# Altium schematic sheet Source_Select.SchDoc: Programming Source Select
size A; Organization: UCLA High Energy Physics; DocumentNumber: 14; Revision: 2.0; SheetNumber: 14; SheetTotal: 23; CurrentDate: 9/6/2018; ModifiedDate: 9/6/2018
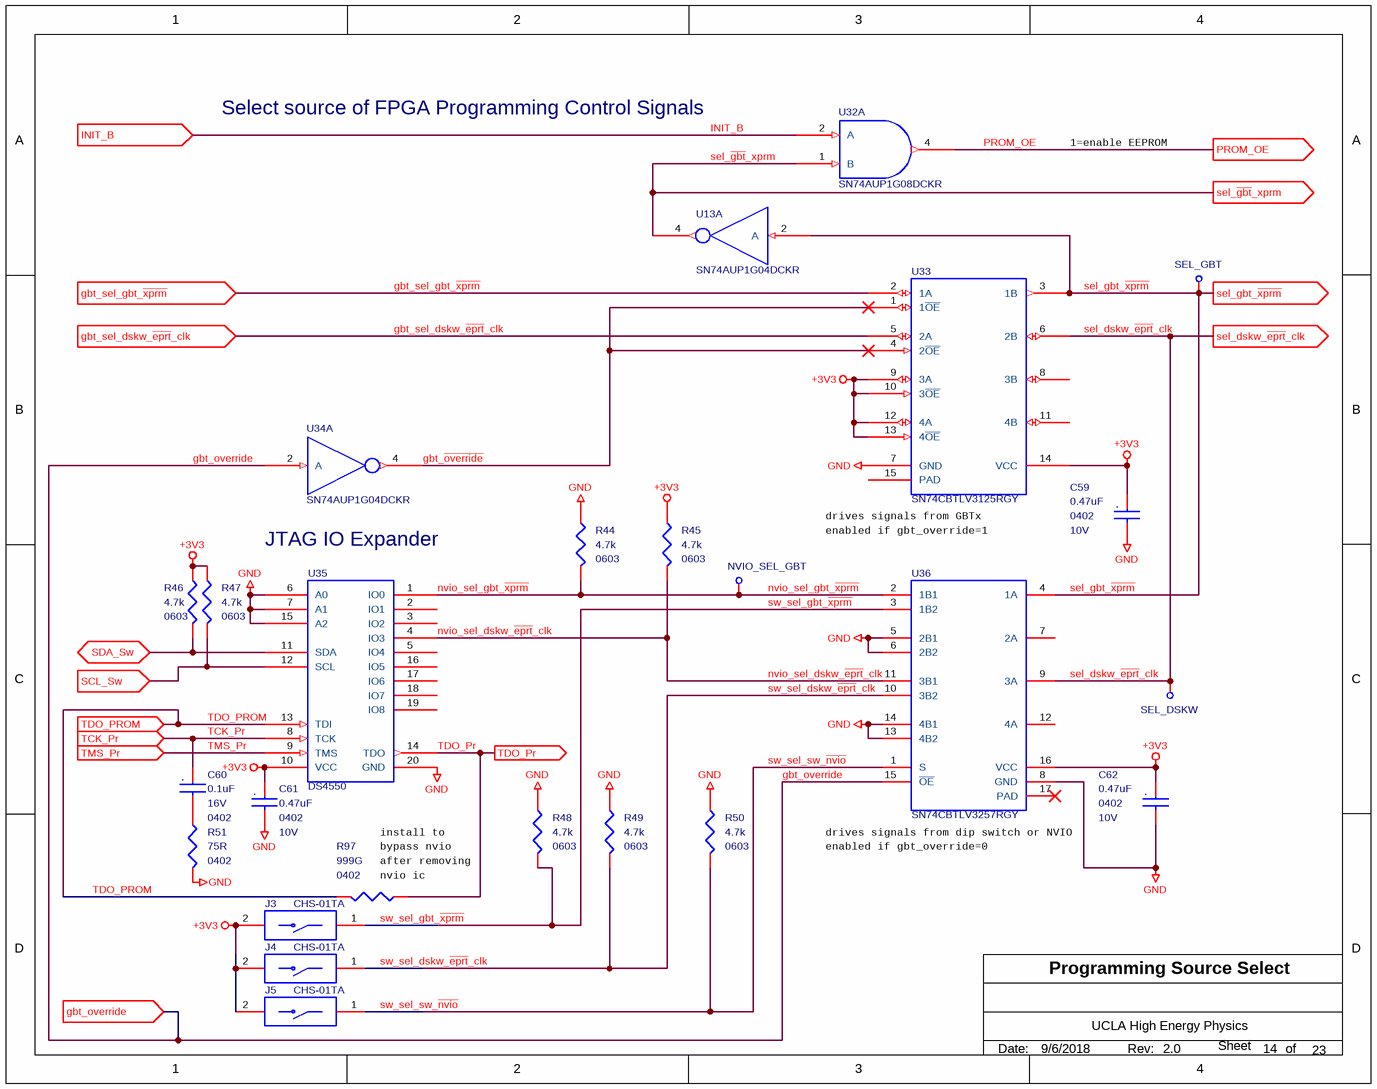
[diagram p0: Source_Select.SchDoc]

## Parts
C59  0.47uF  Voltage - Rated: 10V  package: 0402  [MC_S6/SM/C_0402_IPC]
C60  0.1uF  package: 0402  Voltage - Rated: 16V  [MC_S6/SM/C_0402_IPC]
C61  0.47uF  Voltage - Rated: 10V  package: 0402  [MC_S6/SM/C_0402_IPC]
C62  0.47uF  Voltage - Rated: 10V  package: 0402  [MC_S6/SM/C_0402_IPC]
J3  CHS-01TA  [CHS-01TA]
J4  CHS-01TA  [CHS-01TA]
J5  CHS-01TA  [CHS-01TA]
NVIO_SEL_GBT  Test Point Via  [MC_S6/TH/TPVIA]  (value not drawn)  (no BOM)
R44  4.7k  Supplier Device Package: 0603  [MC_S6/SM/R_0603_IPC]
R45  4.7k  Supplier Device Package: 0603  [MC_S6/SM/R_0603_IPC]
R46  4.7k  Supplier Device Package: 0603  [MC_S6/SM/R_0603_IPC]
R47  4.7k  Supplier Device Package: 0603  [MC_S6/SM/R_0603_IPC]
R48  4.7k  Supplier Device Package: 0603  [MC_S6/SM/R_0603_IPC]
R49  4.7k  Supplier Device Package: 0603  [MC_S6/SM/R_0603_IPC]
R50  4.7k  Supplier Device Package: 0603  [MC_S6/SM/R_0603_IPC]
R51  75R  Supplier Device Package: 0402  [MC_S6/SM/R_0402_IPC]
R97  999G  Supplier Device Package: 0402  [MC_S6/SM/R_0402_IPC]  (no BOM)
SEL_DSKW  Test Point Via  [MC_S6/TH/TPVIA]  (value not drawn)  (no BOM)
SEL_GBT  Test Point Via  [MC_S6/TH/TPVIA]  (value not drawn)  (no BOM)
U13  SN74AUP1G04DCKR  [MC_S6/SM/SOT_SC70_DCK5]  (part A of 2)
U32  SN74AUP1G08DCKR  [MC_S6/SM/SOT_SC70_DCK5]  (part A of 2)
U33  SN74CBTLV3125RGY  [S-PVQFN-N14]
U34  SN74AUP1G04DCKR  [MC_S6/SM/SOT_SC70_DCK5]  (part A of 2)
U35  DS4550  [TSSOP-20]
U36  SN74CBTLV3257RGY  [R-PVQFN-N16]

## Ports
gbt_override (in), gbt_sel_dskw_~{eprt}_clk (in), gbt_sel_gbt_~{xprm} (in), INIT_B (in), PROM_OE (out), SCL_Sw (in), SDA_Sw (bidir), sel_dskw_~{eprt}_clk (out), sel_gbt_~{xprm} (out), sel_~{gbt}_xprm (out), TCK_Pr (in), TDO_Pr (out), TDO_PROM (in), TMS_Pr (in)

## Nets
+3V3: C59.1 C61.1 C62.1 J3.2 J4.2 J5.2 R45.1 R46.1 R47.1 U33.9(3A) U33.10(3~{OE}) U33.12(4A) U33.13(4~{OE}) U33.14(VCC) U35.10(VCC) U36.16(VCC)
GND: C59.2 C61.2 C62.2 R44.1 R48.1 R49.1 R50.1 R51.2 U33.7(GND) U35.6(A0) U35.7(A1) U35.15(A2) U35.20(GND) U36.5(2B1) U36.6(2B2) U36.8(GND) U36.13(4B2) U36.14(4B1)
gbt_~{override}: U33.1(1~{OE}) U33.4(2~{OE}) U34.4(Y)
gbt_override: U34.2(A) U36.15(~{OE}) ; port gbt_override
gbt_sel_dskw_~{eprt}_clk: U33.5(2A) ; port gbt_sel_dskw_~{eprt}_clk
gbt_sel_gbt_~{xprm}: U33.2(1A) ; port gbt_sel_gbt_~{xprm}
INIT_B: U32.2(A) ; port INIT_B
nvio_sel_dskw_~{eprt}_clk: R45.2 U35.4(IO3) U36.11(3B1)
nvio_sel_gbt_~{xprm}: NVIO_SEL_GBT.1(In) R44.2 U35.1(IO0) U36.2(1B1)
PROM_OE: U32.4(Y) ; port PROM_OE
SCL_Sw: R47.2 U35.12(SCL) ; port SCL_Sw
SDA_Sw: R46.2 U35.11(SDA) ; port SDA_Sw
sel_dskw_~{eprt}_clk: SEL_DSKW.1(In) U33.6(2B) U36.9(3A) ; port sel_dskw_~{eprt}_clk
sel_~{gbt}_xprm: U13.4(Y) U32.1(B) ; port sel_~{gbt}_xprm
sel_gbt_~{xprm}: SEL_GBT.1(In) U13.2(A) U33.3(1B) U36.4(1A) ; port sel_gbt_~{xprm}
sw_sel_dskw_~{eprt}_clk: J4.1 R49.2 U36.10(3B2)
sw_sel_gbt_~{xprm}: J3.1 R48.2 U36.3(1B2)
sw_sel_sw_~{nvio}: J5.1 R50.2 U36.1(S)
TCK_Pr: C60.1 U35.8(TCK) ; port TCK_Pr
TDO_Pr: R97.1 U35.14(TDO) ; port TDO_Pr
TDO_PROM: R97.2 U35.13(TDI) ; port TDO_PROM
TMS_Pr: U35.9(TMS) ; port TMS_Pr
NetC60_2: C60.2 R51.1

Not connected (* = marked no-connect by the designer): U33 8(3B) 11(4B) 15(PAD); U35 2(IO1) 3(IO2) 5(IO4) 16(IO5) 17(IO6) 18(IO7) 19(IO8); U36 7(2A) 12(4A) 17(PAD)*

## Notes on the sheet
- Select source of FPGA Programming Control Signals
- 1=enable EEPROM
- enabled if gbt_override=1
- (near U33) drives signals from GBTx
- JTAG IO Expander
- install to
- (near R97) bypass nvio
- (near R97) after removing
- (near R97) nvio ic
- (near U36) enabled if gbt_override=0
- (near U36) drives signals from dip switch or NVIO
- Date:
- Rev:
- of
- Sheet
- (in symbol C0402C104K4RACTU) .
- (in symbol GRM155R61A474KE15D) .

## Library data of the parts
C59 C61 C62 = GRM155R61A474KE15D: CAP CER 0.47UF 10V X5R 0402; Manufacturer: Murata Electronics North America; Capacitance: 0.47µF; Tolerance: ±10%; Supplier 1: Digi-Key; Manufacturer Part Number: GRM155R61A474KE15D; RoHS: RoHS Compliant; Category: Capacitors; Stock 1: 506743; Pricing 1: 1=0.1, 10=0.064, 50=0.0344, 100=0.0292, 250=0.02384, 500=0.0204, 1000=0.0159, 5000=0.01325 (USD); Packaging: Cut Tape (CT); Part Status: Active; Operating Temperature: -55°C ~ 85°C; Features: -; Ratings: -; Applications: General Purpose; Mounting Type: Surface Mount, MLCC; Package / Case: 0402 (1005 Metric); Size / Dimension: 0.039" L x 0.020" W (1.00mm x 0.50mm); Height - Seated (Max): -; Thickness (Max): 0.022" (0.55mm); Lead Spacing: -; Lead Style: -; ComponentLink1URL: http://www.murata.com/~/media/webrenewal/support/library/catalog/products/capacitor/mlcc/c02e.pdf; ComponentLink1Description: http://www.murata.com/~/media/webrenewal/support/library/catalog/products/capacitor/mlcc/c02e.pdf; Supplier 2: Digi-Key; Stock 2: 506743; Pricing 2: 1=0.1, 10=0.064, 50=0.0344, 100=0.0292, 250=0.02384, 500=0.0204, 1000=0.0159, 5000=0.01325 (USD); Supplier Part Number 1: 490-3264-1-ND; Supplier Part Number 2: 490-3264-6-ND; Temperature Coefficient: X5R
C60 = C0402C104K4RACTU: CAP CER 0.1UF 16V X7R 0402; Manufacturer: KEMET; Capacitance: 0.10µF; Tolerance: ±10%; Supplier 1: Digi-Key; Manufacturer Part Number: C0402C104K4RACTU; RoHS: RoHS Compliant; Category: Capacitors; Stock 1: 3565698; Pricing 1: 1=0.11, 10=0.078, 25=0.0568, 50=0.0442, 100=0.0365, 250=0.03024, 500=0.02562, 1000=0.02121, 5000=0.01806 (USD); Packaging: Cut Tape (CT); Part Status: Active; Operating Temperature: -55°C ~ 125°C; Features: -; Ratings: -; Applications: General Purpose; Failure Rate: -; Mounting Type: Surface Mount, MLCC; Package / Case: 0402 (1005 Metric); Size / Dimension: 0.039" L x 0.020" W (1.00mm x 0.50mm); Height - Seated (Max): -; Thickness (Max): 0.022" (0.55mm); Lead Spacing: -; Lead Style: -; ComponentLink1URL: http://www.kemet.com/docfinder?Partnumber=C0402C104K4RACTU; ComponentLink1Description: http://www.kemet.com/docfinder?Partnumber=C0402C104K4RACTU; Supplier 2: Digi-Key; Stock 2: 3565998; Pricing 2: 1=0.11, 10=0.078, 25=0.0568, 50=0.0442, 100=0.0365, 250=0.03024, 500=0.02562, 1000=0.02121, 5000=0.01806 (USD); Supplier Part Number 1: 399-3521-1-ND; Supplier Part Number 2: 399-3521-6-ND; Temperature Coefficient: X7R
J3-J5 = CHS-01TA: SWITCH SLIDE DIP SPST 100MA 6V; Manufacturer: Nidec Copal; Body Material: Polyphenylene; Number of Positions: 1; Electrical Life: 2000Cycles; Max Voltage Rating (DC): 24V; Pitch: 0.05inch; Washable: Yes; ComponentLink1URL: https://www.ctscorp.com/wp-content/uploads/219.pdf; ComponentLink1Description: https://www.ctscorp.com/wp-content/uploads/219.pdf; Supplier 1: Digi-Key; Manufacturer Part Number: CHS-01TA; Stock 1: 148558; Pricing 1: 1=0.98, 10=0.961, 25=0.9056, 50=0.85, 100=0.8131, 250=0.77616, 500=0.70224 (USD); Mount: Surface Mount; Contact Material: Copper Alloy; Contact Plating: Gold; Min Operating Temperature: -40°C; Max Operating Temperature: 85°C; Packaging: Tape and Reel; Throw Configuration: SPST; Voltage Rating (DC): 6V; Current Rating: 100mA; Termination: J-Hook; Orientation: Vertical; Length: 0.098inch; Lead Free: Lead Free; ComponentLink2URL: https://datasheet.ciiva.com/2863/chs-2863448.pdf; ComponentLink2Description: https://datasheet.ciiva.com/2863/chs-2863448.pdf; ComponentLink3URL: https://datasheet.ciiva.com/2863/chs-2863449.pdf; ComponentLink3Description: https://datasheet.ciiva.com/2863/chs-2863449.pdf; ComponentLink4URL: https://datasheet.ciiva.com/2863/chs-2863450.pdf; ComponentLink4Description: https://datasheet.ciiva.com/2863/chs-2863450.pdf; Supplier Part Number 1: 563-1003-1-ND
NVIO_SEL_GBT SEL_DSKW SEL_GBT = TPVIA: COMPSIDE: TOP; COMPGROUP: 0; mfgr: Layout; COMPROT: 0; Package: 90; mfgr_id: TPVIA; mfgr_foot: TPVIA
R44-R50 = CR0603-FX-4701ELF: RES SMD 4.7K OHM 1% 1/10W 0603; Manufacturer: Bourns Inc.; Power (Watts): 0.1W, 1/10W; Temperature Coefficient: ±100ppm/°C; Tolerance: ±1%; Supplier 1: Digi-Key; Manufacturer Part Number: CR0603-FX-4701ELF; RoHS: RoHS Compliant; Category: Resistors; Stock 1: 43560; Pricing 1: 1=0.1, 10=0.021, 100=0.0086, 1000=0.00385, 2500=0.00334 (USD); Packaging: Cut Tape (CT); Part Status: Active; Resistance (Ohms): 4.7k; Composition: Thick Film; Features: Moisture Resistant; Operating Temperature: -55°C ~ 155°C; Package / Case: 0603 (1608 Metric); Size / Dimension: 0.063" L x 0.031" W (1.60mm x 0.80mm); Height - Seated (Max): 0.022" (0.55mm); Failure Rate: -; ComponentLink1URL: http://www.bourns.com/docs/Product-Datasheets/CHPREZTR.pdf; ComponentLink1Description: http://www.bourns.com/docs/Product-Datasheets/CHPREZTR.pdf; Supplier 2: Digi-Key; Stock 2: 43560; Pricing 2: 1=0.1, 10=0.021, 100=0.0086, 1000=0.00385, 2500=0.00334 (USD); Supplier Part Number 1: CR0603-FX-4701ELFCT-ND; Supplier Part Number 2: CR0603-FX-4701ELFDKR-ND
R51 = ERJ-2GEJ750X: RES SMD 75 OHM 5% 1/10W 0402; Manufacturer: Panasonic Electronic Components; Power (Watts): 0.1W, 1/10W; Temperature Coefficient: ±200ppm/°C; Tolerance: ±5%; Supplier 1: Digi-Key; Manufacturer Part Number: ERJ-2GEJ750X; RoHS: RoHS Compliant; Category: Resistors; Stock 1: 127750; Pricing 1: 1=0.1, 10=0.02, 100=0.008, 1000=0.00359, 2500=0.00312, 5000=0.00258 (USD); Packaging: Cut Tape (CT); Part Status: Active; Composition: Thick Film; Features: Automotive AEC-Q200; Operating Temperature: -55°C ~ 155°C; Package / Case: 0402 (1005 Metric); Size / Dimension: 0.039" L x 0.020" W (1.00mm x 0.50mm); Height - Seated (Max): 0.016" (0.40mm); Failure Rate: -; ComponentLink1URL: http://industrial.panasonic.com/www-cgi/jvcr13pz.cgi?E+PZ+3+AOA0001+ERJ2GEJ750X+7+WW; ComponentLink1Description: http://industrial.panasonic.com/www-cgi/jvcr13pz.cgi?E+PZ+3+AOA0001+ERJ2GEJ750X+7+WW; Supplier 2: Digi-Key; Stock 2: 127750; Pricing 2: 1=0.1, 10=0.02, 100=0.008, 1000=0.00359, 2500=0.00312, 5000=0.00258 (USD); Supplier Part Number 1: P75JCT-ND; Supplier Part Number 2: P75JDKR-ND
R97 = RES999G 0402: RES SMD 999G OHM 5% 1/16W 0402; Manufacturer Part Number: Do Not Place
U13 U34 = SN74AUP1G04DCKR: IC INVERTER LP 5TSSOP; Manufacturer: Texas Instruments; Number of Inputs: 1; Voltage - Supply: 0.8 V ~ 3.6 V; Current - Output High, Low: 4mA, 4mA; Logic Level - Low: 0.7 V ~ 0.9 V; Logic Level - High: 1.6 V ~ 2 V; Max Propagation Delay @ V, Max CL: 5.4ns @ 3.3V, 30pF; Supplier 1: Digi-Key; Manufacturer Part Number: SN74AUP1G04DCKR; RoHS: RoHS Compliant; Category: Integrated Circuits (ICs); Stock 1: 7270; Pricing 1: 1=0.48, 10=0.364, 100=0.227, 500=0.15532, 1000=0.11948 (USD); Packaging: Digi-Reel®; Part Status: Active; Logic Type: Inverter; Features: -; Operating Temperature: -40°C ~ 85°C; Mounting Type: Surface Mount; Supplier Device Package: SC-70-5; Package / Case: 5-TSSOP, SC-70-5, SOT-353; ComponentLink1URL: http://www.ti.com/lit/ds/symlink/sn74aup1g04.pdf; ComponentLink1Description: http://www.ti.com/lit/ds/symlink/sn74aup1g04.pdf; Supplier 2: Digi-Key; Stock 2: 7270; Pricing 2: 1=0.48, 10=0.364, 100=0.227, 500=0.15532, 1000=0.11948 (USD); Supplier Part Number 1: 296-19072-6-ND; Supplier Part Number 2: 296-19072-1-ND
U32 = SN74AUP1G08DCKR: IC GATE AND 1CH 2-INP 5-TSSOP; Manufacturer: Texas Instruments; Manufacturer Part Number: SN74AUP1G08DCKT; Logic Type: AND Gate; Number of Inputs: 2; Voltage - Supply: 0.8 V ~ 3.6 V; Current - Output High, Low: 4mA, 4mA; Logic Level - Low: 0.7 V ~ 0.9 V; Logic Level - High: 1.6 V ~ 2 V; Max Propagation Delay @ V, Max CL: 6.2ns @ 3.3V, 30pF; Supplier 1: Digi-Key; RoHS: RoHS Compliant; Category: Integrated Circuits (ICs); Stock 1: 7470; Pricing 1: 1=0.8, 10=0.707, 100=0.542 (USD); Packaging: Cut Tape (CT); Part Status: Active; Features: -; Operating Temperature: -40°C ~ 85°C; Mounting Type: Surface Mount; Supplier Device Package: SC-70-5; Package / Case: 5-TSSOP, SC-70-5, SOT-353; ComponentLink1URL: http://www.ti.com/lit/ds/symlink/sn74aup1g08.pdf; ComponentLink1Description: http://www.ti.com/lit/ds/symlink/sn74aup1g08.pdf; Supplier 2: Digi-Key; Stock 2: 7470; Pricing 2: 1=0.8, 10=0.707, 100=0.542 (USD); Supplier Part Number 1: 296-32258-1-ND; Supplier Part Number 2: 296-32258-6-ND
U33 = SN74CBTLV3125RGY: IC 4 BIT FET BUS SWITCH, QFN-14; Manufacturer: Texas Instruments; Manufacturer Part Number: SN74CBTLV3125RGYR; Circuit: 1 x 1:1; Voltage - Supply: 2.3 V ~ 3.6 V; Voltage Supply Source: Single Supply; Category: Integrated Circuits (ICs); ComponentLink1Description: http://www.ti.com/lit/ds/symlink/sn74cbtlv3125.pdf; ComponentLink1URL: http://www.ti.com/lit/ds/symlink/sn74cbtlv3125.pdf; Current - Output High, Low: -; Mounting Type: Surface Mount; Operating Temperature: -40°C ~ 85°C; Package / Case: 14-VFQFN Exposed Pad; Packaging: Cut Tape (CT); Part Status: Active; Pricing 1: 1=0.93, 10=0.83, 100=0.6467, 500=0.53426, 1000=0.42179 (USD); Pricing 2: 1=0.93, 10=0.83, 100=0.6467, 500=0.53426, 1000=0.42179 (USD); RoHS: RoHS Compliant; Stock 1: 3196; Stock 2: 3196; Supplier 1: Digi-Key; Supplier 2: Digi-Key; Supplier Device Package: 14-VQFN (3.5x3.5); Supplier Part Number 1: 296-15103-1-ND; Supplier Part Number 2: 296-15103-6-ND; Type: Bus Switch
U35 = DS4550: IC I/O EXPANDER I2C 9B 20TSSOP; Manufacturer: Maxim; Manufacturer Part Number: DS4550E+; Interface: I2C,Serial; Frequency: 400KHz; Number of I/Os: 9; Min Supply Voltage: 2.7V; Max Supply Voltage: 5.5V; Operating Supply Current: 2uA; Supplier 1: Digikey; Stock 1: 76; Pricing 1: 1=3.98, 10=3.781, 25=3.49, 50=3.3154, 100=3, 250=2.85, 1000=2.0808 (USD); Case/Package: TSSOP; Number of Pins: 20; Weight: 0.006737oz; Min Operating Temperature: -40°C; Max Operating Temperature: 85°C; Packaging: Rail/Tube; Package Quantity: 74; Max Frequency: 400KHz; Lead Free: Lead Free; REACH SVHC: Unknown; ComponentLink1URL: https://datasheet.ciiva.com/1781/ds4550-1781162.pdf; ComponentLink1Description: https://datasheet.ciiva.com/1781/ds4550-1781162.pdf; ComponentLink2URL: https://datasheet.ciiva.com/16618/ds4550-16618826.pdf; ComponentLink2Description: https://datasheet.ciiva.com/16618/ds4550-16618826.pdf; Supplier Part Number 1: DS4550E+-ND
U36 = SN74CBTLV3257RGY: IC 4 BIT FET BUS SWITCH, VQFN-16; Manufacturer: Texas Instruments; Manufacturer Part Number: SN74CBTLV3257RGYR; Circuit: 4 x 2:1; Voltage - Supply: 2.3 V ~ 3.6 V; Voltage Supply Source: Single Supply; Category: Integrated Circuits (ICs); ComponentLink1Description: http://www.ti.com/lit/ds/symlink/sn74cbtlv3257.pdf; ComponentLink1URL: http://www.ti.com/lit/ds/symlink/sn74cbtlv3257.pdf; Current - Output High, Low: -; Mounting Type: Surface Mount; Operating Temperature: -40°C ~ 85°C; Package / Case: 16-VFQFN Exposed Pad; Packaging: Cut Tape (CT); Part Status: Active; Pricing 1: 1=0.93, 10=0.83, 100=0.6467, 500=0.53426, 1000=0.42179 (USD); Pricing 2: 1=0.93, 10=0.83, 100=0.6467, 500=0.53426, 1000=0.42179 (USD); RoHS: RoHS Compliant; Stock 1: 4734; Stock 2: 4734; Supplier 1: Digi-Key; Supplier 2: Digi-Key; Supplier Device Package: 16-VQFN (4x4); Supplier Part Number 1: 296-15107-1-ND; Supplier Part Number 2: 296-15107-6-ND; Type: Multiplexer/Demultiplexer